# Altium schematic sheet 7_RS485_RS232_Sensor.SchDoc
size A4
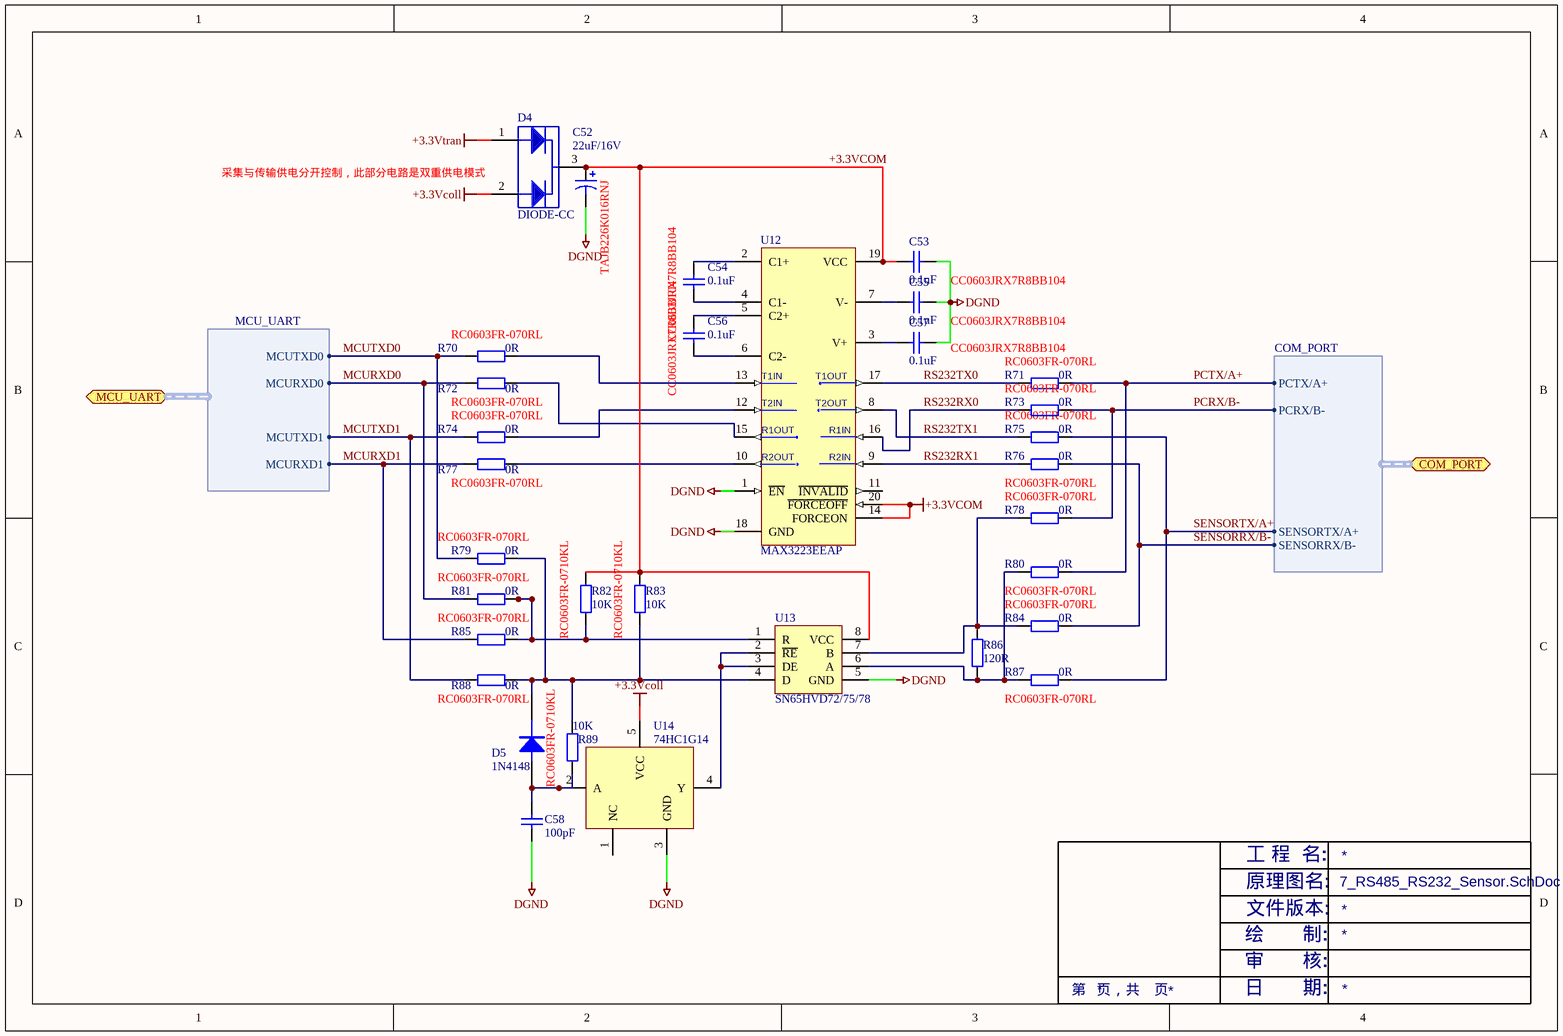
[diagram p0: 7_RS485_RS232_Sensor.SchDoc]

## Parts
C52  22uF/16V  Part No.: TAJB226K016RNJ  [CB3528]
C53  0.1uF  Type No.: CC0603JRX7R8BB104  [CC0603]
C54  0.1uF  Type No.: CC0603JRX7R8BB104  [CC0603]
C55  0.1uF  Type No.: CC0603JRX7R8BB104  [CC0603]
C56  0.1uF  Type No.: CC0603JRX7R8BB104  [CC0603]
C57  0.1uF  Type No.: CC0603JRX7R8BB104  [CC0603]
C58  100pF  [CC0603]
D4  DIODE-CC  [SOT-23W]
D5  1N4148  [SOD323]
R70  0R  Type No.: RC0603FR-070RL  [CC0603]
R71  0R  Type No.: RC0603FR-070RL  [CC0603]
R72  0R  Type No.: RC0603FR-070RL  [CC0603]
R73  0R  Type No.: RC0603FR-070RL  [CC0603]
R74  0R  Type No.: RC0603FR-070RL  [CC0603]
R75  0R  Type No.: RC0603FR-070RL  [CC0603]
R76  0R  Type No.: RC0603FR-070RL  [CC0603]
R77  0R  Type No.: RC0603FR-070RL  [CC0603]
R78  0R  Type No.: RC0603FR-070RL  [CC0603]
R79  0R  Type No.: RC0603FR-070RL  [CC0603]
R80  0R  Type No.: RC0603FR-070RL  [CC0603]
R81  0R  Type No.: RC0603FR-070RL  [CC0603]
R82  10K  Type No.: RC0603FR-0710KL  [CC0603]
R83  10K  Type No.: RC0603FR-0710KL  [CC0603]
R84  0R  Type No.: RC0603FR-070RL  [CC0603]
R85  0R  Type No.: RC0603FR-070RL  [CC0603]
R86  120R  [CC0603]
R87  0R  Type No.: RC0603FR-070RL  [CC0603]
R88  0R  Type No.: RC0603FR-070RL  [CC0603]
R89  10K  Type No.: RC0603FR-0710KL  [CC0603]
U12  MAX3223EEAP  [TSSOP20]
U13  SN65HVD72/75/78  [SO-8]
U14  74HC1G14  [SOT-23-5]

## Ports
COM_PORT (harness COM_PORT), MCU_UART (harness MCU_UART)

## Harnesses
MCU_UART: MCUTXD1, MCURXD1, MCURXD0, MCUTXD0
COM_PORT: PCTX/A+, PCRX/B-, SENSORRX/B-, SENSORTX/A+

## Nets
+3.3Vcoll: D4.2 U14.5(VCC)
+3.3VCOM: C52.1 C53.2 D4.3 R82.2 R83.2 U12.14(FORCEON) U12.19(VCC) U12.20(~{FORCEOFF}) U13.8(VCC)
+3.3Vtran: D4.1
DGND: C52.2 C53.1 C55.1 C57.1 C58.1 U12.1(~{EN}) U12.18(GND) U13.5(GND) U14.3(GND)
MCURXD0: R72.1 R81.1 ; port MCU_UART.MCURXD0
MCURXD1: R77.1 R85.1 ; port MCU_UART.MCURXD1
MCUTXD0: R70.1 R79.1 ; port MCU_UART.MCUTXD0
MCUTXD1: R74.1 R88.1 ; port MCU_UART.MCUTXD1
PCRX/B-: R73.2 R78.2 ; port COM_PORT.PCRX/B-
PCTX/A+: R71.2 R80.2 ; port COM_PORT.PCTX/A+
RS232RX0: R73.1 U12.16(R1IN)
RS232RX1: R76.1 U12.9(R2IN)
RS232TX0: R71.1 U12.17(T1OUT)
RS232TX1: R75.1 U12.8(T2OUT)
SENSORRX/B-: R76.2 R84.2 ; port COM_PORT.SENSORRX/B-
SENSORTX/A+: R75.2 R87.2 ; port COM_PORT.SENSORTX/A+
NetC54_1: C54.1 U12.4(C1-)
NetC54_2: C54.2 U12.2(C1+)
NetC55_2: C55.2 U12.7(V-)
NetC56_1: C56.1 U12.6(C2-)
NetC56_2: C56.2 U12.5(C2+)
NetC57_2: C57.2 U12.3(V+)
NetC58_2: C58.2 D5.1(A) R89.1 U14.2(A)
NetD5_2: D5.2(K) R79.2 R83.1 R88.2 R89.2 U13.4(D)
NetR70_2: R70.2 U12.13(T1IN)
NetR72_2: R72.2 U12.15(R1OUT)
NetR74_2: R74.2 U12.12(T2IN)
NetR77_2: R77.2 U12.10(R2OUT)
NetR78_1: R78.1 R84.1 R86.2 U13.7(B)
NetR80_1: R80.1 R86.1 R87.1 U13.6(A)
NetR81_2: R81.2 R82.1 R85.2 U13.1(R)
NetU13_2: U13.2(~{RE}) U13.3(DE) U14.4(Y)

Not connected (* = marked no-connect by the designer): U12 11(~{INVALID}); U14 1(NC)

## Notes on the sheet
- 采集与传输供电分开控制，此部分电路是双重供电模式
- 文件版本:
- 原理图名:
- 工 程  名:
- 绘       制:
- 审       核:
- 第   页，共    页
- 日       期:

## Library data of the parts
C52 = Cap Pol1: Polarized Capacitor (Radial)
C53-C58 = Cap: Capacitor
D5 = DIODE
R70-R85 R87-R89 = Res2: Resistor
R86 = Res2: Resistor; Value: 1K; Published: 8-Jun-2000; LatestRevisionDate: 17-Jul-2002; LatestRevisionNote: Re-released for DXP Platform.; PackageReference: AXIAL-0.4; Publisher: Altium Limited